# Altium schematic sheet Sheet3.SchDoc
size A3; SheetNumber: 1; SheetTotal: 2
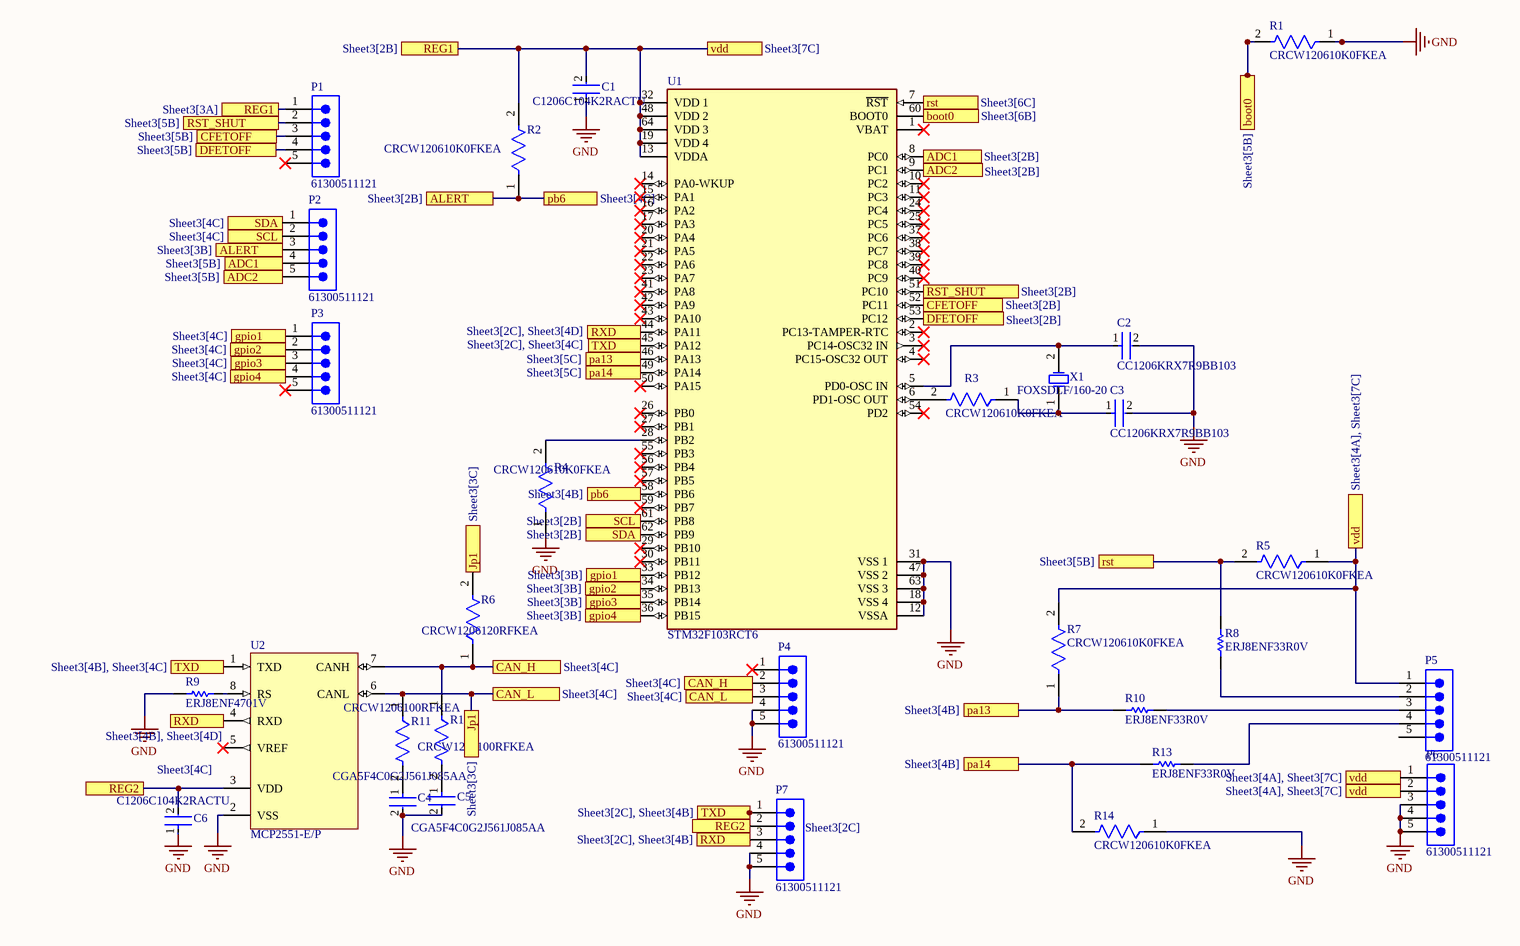
[diagram p0: Sheet3.SchDoc]

## Parts
C1  C1206C104K2RACTU  [FP-C1206C-EB-MFG]
C2  CC1206KRX7R9BB103  [FP-CC1206-1_25-MFG]
C3  CC1206KRX7R9BB103  [FP-CC1206-1_25-MFG]
C4  CGA5F4C0G2J561J085AA  [FP-CGA5L-0_3-0_1-MFG]
C5  CGA5F4C0G2J561J085AA  [FP-CGA5L-0_3-0_1-MFG]
C6  C1206C104K2RACTU  [FP-C1206C-EB-MFG]
P1  61300511121  [61300511121]
P2  61300511121  [61300511121]
P3  61300511121  [61300511121]
P4  61300511121  [61300511121]
P5  61300511121  [61300511121]
P6  61300511121  [61300511121]
P7  61300511121  [61300511121]
R1  CRCW120610K0FKEA  [FP-CRCW1206-e3-IPC_C]
R2  CRCW120610K0FKEA  [FP-CRCW1206-e3-IPC_C]
R3  CRCW120610K0FKEA  [FP-CRCW1206-e3-IPC_C]
R4  CRCW120610K0FKEA  [FP-CRCW1206-e3-IPC_C]
R5  CRCW120610K0FKEA  [FP-CRCW1206-e3-IPC_C]
R6  CRCW1206120RFKEA  [FP-CRCW1206-e3-MFG]
R7  CRCW120610K0FKEA  [FP-CRCW1206-e3-IPC_C]
R8  ERJ8ENF33R0V  [RESC3216X70X50LL05T20]
R9  ERJ8ENF4701V  [RESC3216X70X50LL05T20]
R10  ERJ8ENF33R0V  [RESC3216X70X50LL05T20]
R11  CRCW1206100RFKEA  [FP-CRCW1206-e3-MFG]
R12  CRCW1206100RFKEA  [FP-CRCW1206-e3-MFG]
R13  ERJ8ENF33R0V  [RESC3216X70X50LL05T20]
R14  CRCW120610K0FKEA  [FP-CRCW1206-e3-IPC_C]
U1  STM32F103RCT6  [FP-LQFP64-5W-MFG]
U2  MCP2551-E/P  [PDIP300-P8]
X1  FOXSDLF/160-20  [FOX-FOXSDLF160-20_V]

## Ports
ADC1 (see Sheet3[2B]), ADC1 (see Sheet3[5B]), ADC2 (see Sheet3[2B]), ADC2 (see Sheet3[5B]), ALERT (see Sheet3[2B]), ALERT (see Sheet3[3B]), boot0 (see Sheet3[5B]), boot0 (see Sheet3[6B]), CAN_H (see Sheet3[4C]), CAN_L (see Sheet3[4C]), CFETOFF (see Sheet3[2B]), CFETOFF (see Sheet3[5B]), DFETOFF (see Sheet3[2B]), DFETOFF (see Sheet3[5B]), gpio1 (see Sheet3[3B]), gpio1 (see Sheet3[4C]), gpio2 (see Sheet3[3B]), gpio2 (see Sheet3[4C]), gpio3 (see Sheet3[3B]), gpio3 (see Sheet3[4C]), gpio4 (see Sheet3[3B]), gpio4 (see Sheet3[4C]), Jp1 (see Sheet3[3C]), pa13 (see Sheet3[4B]), pa13 (see Sheet3[5C]), pa14 (see Sheet3[4B]), pa14 (see Sheet3[5C]), pb6 (see Sheet3[4B]), pb6 (see Sheet3[4C]), REG1 (see Sheet3[2B]), REG1 (see Sheet3[3A]), REG2 (see Sheet3[2C]), REG2 (see Sheet3[4C]), rst (see Sheet3[5B]), rst (see Sheet3[6C]), RST_SHUT (see Sheet3[2B]), RST_SHUT (see Sheet3[5B]), RXD (see Sheet3[2C], Sheet3[4B]), RXD (see Sheet3[2C], Sheet3[4D]), RXD (see Sheet3[4B], Sheet3[4D]), SCL (see Sheet3[2B]), SCL (see Sheet3[4C]), SDA (see Sheet3[2B]), SDA (see Sheet3[4C]), TXD (see Sheet3[2C], Sheet3[4B]), TXD (see Sheet3[2C], Sheet3[4C]), TXD (see Sheet3[4B], Sheet3[4C]), vdd (see Sheet3[4A], Sheet3[7C]), vdd (see Sheet3[7C])

## Nets
GND: C1.1 C2.2 C3.2 C4.2 C5.2 C6.1 P4.4 P4.5 P6.3 P6.4 P6.5 P7.4 P7.5 R1.1 R4.1 R9.1 R14.1 U1.12(VSSA) U1.18(VSS_4) U1.31(VSS_1) U1.47(VSS_2) U1.63(VSS_3) U2.2(VSS)
ADC1: P2.4 U1.8(PC0) ; port ADC1
ADC2: P2.5 U1.9(PC1) ; port ADC2
ALERT: P2.3 R2.1 U1.58(PB6) ; port ALERT, port pb6
boot0: R1.2 U1.60(BOOT0) ; port boot0
CAN_H: P4.2 R6.1 R12.1 U2.7(CANH) ; port CAN_H
CAN_L: P4.3 R6.2 R11.1 U2.6(CANL) ; port Jp1, port CAN_L
CFETOFF: P1.3 U1.52(PC11) ; port CFETOFF
DFETOFF: P1.4 U1.53(PC12) ; port DFETOFF
gpio1: P3.1 U1.33(PB12) ; port gpio1
gpio2: P3.2 U1.34(PB13) ; port gpio2
gpio3: P3.3 U1.35(PB14) ; port gpio3
gpio4: P3.4 U1.36(PB15) ; port gpio4
pa13: R7.1 R10.1 U1.46(PA13) ; port pa13
pa14: R13.1 R14.2 U1.49(PA14) ; port pa14
REG1: C1.2 P1.1 P5.1 P6.1 P6.2 R2.2 R5.1 R7.2 U1.13(VDDA) U1.19(VDD_4) U1.32(VDD_1) U1.48(VDD_2) U1.64(VDD_3) ; port vdd, port REG1
REG2: C6.2 P7.2 U2.3(VDD) ; port REG2
rst: R5.2 R8.2 U1.7(~{RST}) ; port rst
RST_SHUT: P1.2 U1.51(PC10) ; port RST_SHUT
RXD: P7.3 U1.44(PA11) U2.4(RXD) ; port RXD
SCL: P2.2 U1.61(PB8) ; port SCL
SDA: P2.1 U1.62(PB9) ; port SDA
TXD: P7.1 U1.45(PA12) U2.1(TXD) ; port TXD
NetC2_1: C2.1 U1.5(PD0-OSC_IN) X1.2(X2)
NetC3_1: C3.1 R3.1 X1.1(X1)
NetC4_1: C4.1 R11.2
NetC5_1: C5.1 R12.2
NetP5_2: P5.2 R8.1
NetP5_3: P5.3 R10.2
NetP5_4: P5.4 R13.2
NetR3_2: R3.2 U1.6(PD1-OSC_OUT)
NetR4_2: R4.2 U1.28(PB2)
NetR9_2: R9.2 U2.8(RS)

Not connected (* = marked no-connect by the designer): P1 5*; P3 5*; P4 1*; P5 5; U1 1(VBAT)* 2(PC13-TAMPER-RTC)* 3(PC14-OSC32_IN)* 4(PC15-OSC32_OUT)* 10(PC2)* 11(PC3)* 14(PA0-WKUP)* 15(PA1)* 16(PA2)* 17(PA3)* 20(PA4)* 21(PA5)* 22(PA6)* 23(PA7)* 24(PC4)* 25(PC5)* 26(PB0)* 27(PB1)* 29(PB10)* 30(PB11)* 37(PC6)* 38(PC7)* 39(PC8)* 40(PC9)* 41(PA8)* 42(PA9)* 43(PA10)* 50(PA15)* 54(PD2)* 55(PB3)* 56(PB4)* 57(PB5)* 59(PB7)*; U2 5(VREF)*

## Library data of the parts
C1 C6 = CMP-1037-04222-2: CAP CER 0.1UF 200V 10% X7R 1206; Manufacturer: KEMET; Automotive Grade: Grade 0; Tolerance: 0.1; Value: 0.10 μF; Material: Ceramic; Temperature Coefficient: 15%; Automotive: Yes; Temperature Characteristic: X7R; Digikey Description: CAP CER 0.1UF 200V 10% X7R 1206; ComponentLink2URL: https://content.kemet.com/datasheets/KEM_C1007_X8R_ULTRA_150C_SMD.pdf; Voltage Rating: 200 V; Manufacturer Part Number: C1206C104K2RACTU; Temperature Range High: +150°C; Device Class L1: Passive Components; Octopart: https://octopart.com/c1206c104k2ractu-kemet-9138344; Temperature: -55°C to +150°C; Height: 0.88mm; Device Class L3: Ceramic Capacitors; Lead Free: Yes; Package: C1206C-EB; Category: Cap; Temperature Range Low: -55°C; Mouser Description: Multilayer Ceramic Capacitors MLCC - SMD/SMT 200volts 0.1uF X7R 10%; Ipc Land Pattern Name: CAPC320160X78; Capacitance: 0.10 μF; RoHS: TRUE; ComponentLink2Description: Datasheet; Device Class L2: Capacitors
C2 C3 = CMP-1037-03511-2: CAP CER 10000PF 50V X7R 1206; Manufacturer: Yageo; Automotive Grade: NA; Temperature Coefficient: 15%; Tolerance: 0.1; Capacitance: 10 nF; Value: 10 nF; Material: Ceramic; RoHS: TRUE; Lead Free: Yes; Category: Cap; Temperature Characteristic: X7R; ComponentLink2Description: Datasheet; Device Class L2: Capacitors; Voltage Rating: 50 V; Octopart: https://octopart.com/cc1206krx7r9bb103-yageo-39467800; Temperature Range Low: -55°C; Digikey Description: CAP CER 10000PF 50V X7R 1206; ComponentLink2URL: http://www.yageo.com/documents/recent/UPY-NP0X7R_HV_1KV-to-3KV_11.pdf; Package: CC1206-1.25; Height: 1.45mm; Automotive: No; Mouser Description: Multilayer Ceramic Capacitors MLCC - SMD/SMT 10nF 50V X7R 10%; Temperature Range High: +125°C; Manufacturer Part Number: CC1206KRX7R9BB103; Device Class L3: Ceramic Capacitors; Temperature: -55°C to +125°C; Footprint Url: http://www.yageo.com/exep/pages/download/literatures/UPY-C_GEN_24.pdf; Device Class L1: Passive Components
C4 C5 = CMP-08246-001106-1: Cap Ceramic 560pF 630V C0G 5% Pad SMD 1206 +125°C Automotive T/R; Height: 0.85mm; Mount: Surface Mount; Packaging: Tape and Reel; Thickness: 0.03inch; Case/Package: 1206; REACH SVHC: No SVHC; Ratings: AEC-Q200; Termination: SMD/SMT; Voltage Rating (DC): 630V; Package Quantity: 1; Dielectric: C0G; Width: 1.6mm; Tolerance: 5%; Depth: 1.6mm; Weight: 0.000571oz; Case Code (Metric): 3216; Length: 3.2mm; Capacitance: 560pF; Case Code (Imperial): 1206; Composition: Ceramic; Voltage Rating: 630V; Min Operating Temperature: -55°C; Max Operating Temperature: 125°C
P1-P7 = CMP-1502-01068-3: NexarPartId: 32855526; Connector Type: Male Pin; Gender: Male; Contact Resistance: 20mΩ; Pitch: 2.54mm; Operating Supply Voltage: 250V; Current Rating: 3A; Number of Contacts: 5; Lead Free: Lead Free; Color: Black; Packaging: Bulk; Lead Pitch: 2.54mm; Contact Material: Copper; Min Operating Temperature: -40°C; Contact Mating Length: 5.9944mm; Voltage Rating: 250V; Number of Pins: 5; Number of Positions: 5; Height: 8.89mm; Orientation: Vertical; REACH SVHC: Unknown; RoHS: Compliant; Contact Plating: Gold; Max Operating Temperature: 105°C; Mount: Through Hole; Number of Rows: 1; Termination: Solder
R1-R5 R7 R14 = CMP-2003-04807-2: RES Thick Film, 10kΩ, 1%, 0.25W, 100ppm/°C, 1206; Working Voltage: 200V; Max Power Dissipation: 250mW; Resistance: 10kR; Tolerance: 1%; Width: 0.063inch; Height: 0.55mm; Number of Pins: 2; Voltage Rating: 200V; Temperature Coefficient: 100ppm/°C; Military Standard: Not; Features: Automotive AEC-Q200; Depth: 1.6mm; Radiation Hardening: No; Termination: SMD/SMT; Case Code (Imperial): 1206; Weight: 0.000353oz; Length: 3.2mm; Package Quantity: 10; Voltage Rating (DC): 200V; Case/Package: 1206; Min Operating Temperature: -55°C; Number of Terminations: 2; Composition: Thick Film; Contact Plating: Tin; Power Rating: 250mW; Packaging: Tape and Reel; Max Operating Temperature: 155°C; Lead Free: Lead Free; Case Code (Metric): 3216
R6 = CMP-2003-04838-2: RES Thick Film, 120Ω, 1%, 0.25W, 100ppm/°C, 1206; Power Rating: 250mW; Voltage Rating: 200V; Resistance: 120R; Length: 3.2mm; Tolerance: 1%; Weight: 0.000353oz; Temperature Coefficient: 100ppm/°C; Case/Package: 1206; Lead Free: Lead Free; Case Code (Metric): 3216; Min Operating Temperature: -55°C; Package Quantity: 10; Mount: Surface Mount; Height: 0.55mm; Packaging: Tape and Reel; Number of Terminations: 2; Composition: Thick Film; Width: 0.063inch; Voltage Rating (DC): 200V; Radiation Hardening: No; Contact Plating: Tin; Case Code (Imperial): 1206; Termination: SMD/SMT; Max Power Dissipation: 250mW; Features: Automotive AEC-Q200; Military Standard: Not; Depth: 1.6mm; Max Operating Temperature: 155°C
R8 R10 R13 = CMP-2003-00837-1: Manufacturer: Panasonic; Part Number: ERJ8ENF33R0V
R9 = CMP-2003-00848-1: Manufacturer: Panasonic; Part Number: ERJ8ENF4701V
R11 R12 = CMP-2003-04801-2: RES Thick Film, 100Ω, 1%, 0.25W, 100ppm/°C, 1206; Voltage Rating (DC): 200V; Resistance: 100R; Power Rating: 250mW; Case Code (Metric): 3216; Radiation Hardening: No; Height: 0.55mm; Packaging: Tape and Reel; Depth: 1.6mm; Weight: 0.000353oz; Termination: SMD/SMT; Lead Free: Lead Free; Min Operating Temperature: -55°C; Contact Plating: Tin; Max Operating Temperature: 155°C; Case Code (Imperial): 1206; Military Standard: Not; Width: 1.6mm; Number of Pins: 2; Voltage Rating: 200V; Composition: Thick Film; Package Quantity: 5000; Tolerance: 1%; Case/Package: 1206; Mount: Surface Mount; Length: 3.2mm; Temperature Coefficient: 100ppm/°C
U1 = CMP-0237-00009-5: IC MCU 32BIT 256KB FLASH 64LQFP; Interface: I2C; Number of I/Os: 51; Number of SPI Channels: 3; Min Supply Voltage: 2V; Peripherals: POR; Max Frequency: 72MHz; Max Power Dissipation: 444mW; Number of Timers/Counters: 8; Data Bus Width: 32b; Number of ADC Channels: 16; RAM Size: 48KB; Max Supply Voltage: 3.6V; Number of I2C Channels: 2; Watchdog Timer: Yes; Oscillator Type: Internal; Core Architecture: ARM; Number of Bits: 32; Package Quantity: 960; REACH SVHC: No SVHC; Width: 10mm; Weight: 0.012088oz; Max Operating Temperature: 85°C; Radiation Hardening: No; Length: 10mm; Height: 1.4mm; Number of Programmable I/O: 51; Frequency: 72MHz; Series: STM32F103RC; Min Operating Temperature: -40°C; Number of PWM Channels: 16; Memory Size: 256KB; Lead Free: Lead Free; Packaging: Tray; Termination: SMD/SMT; RoHS Compliant: Yes; Number of Pins: 64; Case/Package: LQFP; Density: 256KB; Memory Type: FLASH
U2 = CMP-0186-00100-2: High-Speed CAN Transceiver, 8-Pin PDIP, Extended Temperature; PackageReference: PDIP300-P8; DatasheetVersion: revF, Jul-2010; ComponentLink2URL: http://ww1.microchip.com/downloads/en/DeviceDoc/21667F.pdf; ComponentLink2Description: Datasheet; Code_JEDEC: MS-001; ComponentLink1URL: http://www.microchip.com/; RevisionNote: URLs added. DatasheetVersion updated.; PackageVersion: revBB, Aug-2009; ComponentLink3Description: Package Specification; PackageDescription: 8-Lead Plastic Dual In-Line (P) - 300 mil Body [PDIP]; ComponentLink1Description: Manufacturer URL; ComponentLink3URL: http://www.microchip.com/stellent/groups/techpub_sg/documents/packagingspec/en012702.pdf
X1 = CMP-1749-00001-1: Resistance Weld SMD Crystal, 16 MHz, +/- 30 ppm, 20 pF, -20 to 70 degC, 2-Pin SMD, RoHS, Tape and Reel; Output Current: 3 mA; Case\Package: SOT-553-6; Min Supply Voltage (DC): 4 V; Max Supply Voltage: 3.3 V; Min Supply Voltage: 1.4 V; Interface: I2C; Max Supply Voltage (DC): 6 V; ComponentLink2Description: Datasheet; REACH SVHC: No SVHC; ComponentLink1URL: http://www.foxonline.com/; ComponentLink2URL: http://foxonline.com/pdfs/hc49sdlf.pdf; Pins: 6; Packaging: Cut Tape; ComponentLink1Description: Manufacturer URL; Weight: 9.9E-05 oz; Length: 1.6 mm; RoHSCompliant: true; Min Operating Temperature: -55 degC; Radiation Hardening: No; PackageDescription: 2-Pin Surface Mount Device, Body 5 x 11.7 mm, Height 4.5 mm; Package Quantity: 1; Width: 1.2 mm; DatasheetVersion: Mar-15; Max Operating Temperature: 150 degC; Mount: Surface Mount; PackageReference: FOX-FOXSDLF160-20; Height: 0.55 mm